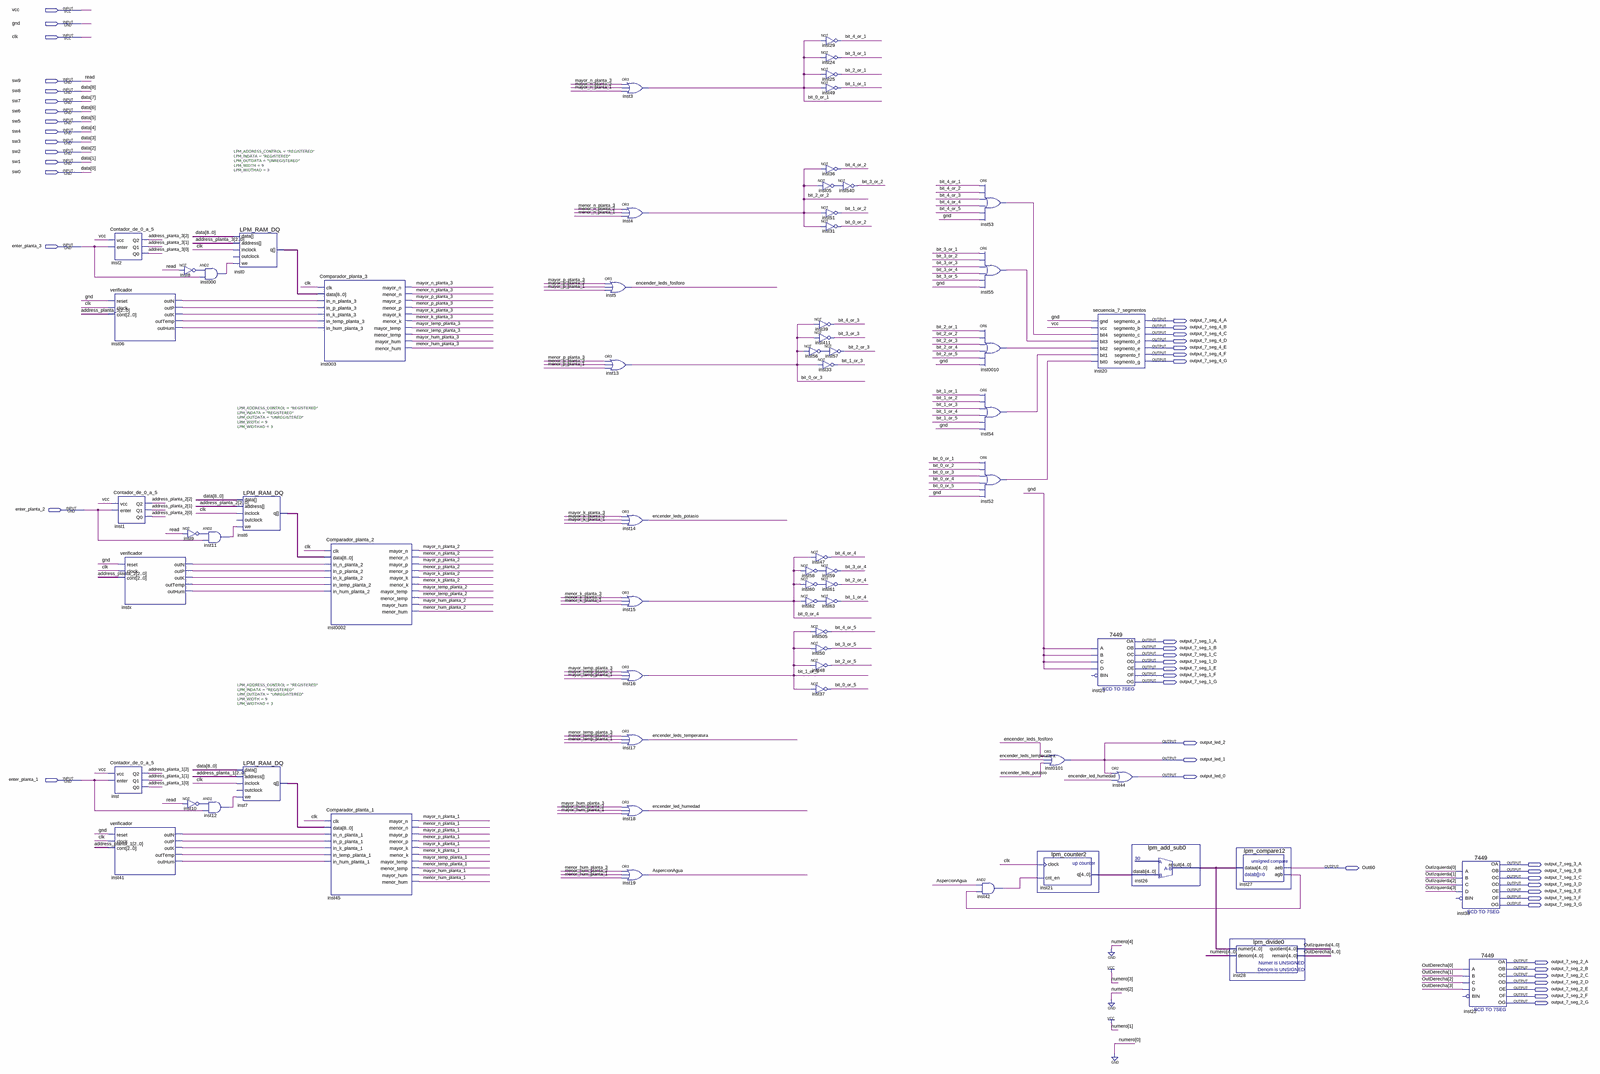
[diagram p0: schematic sheet, whole]
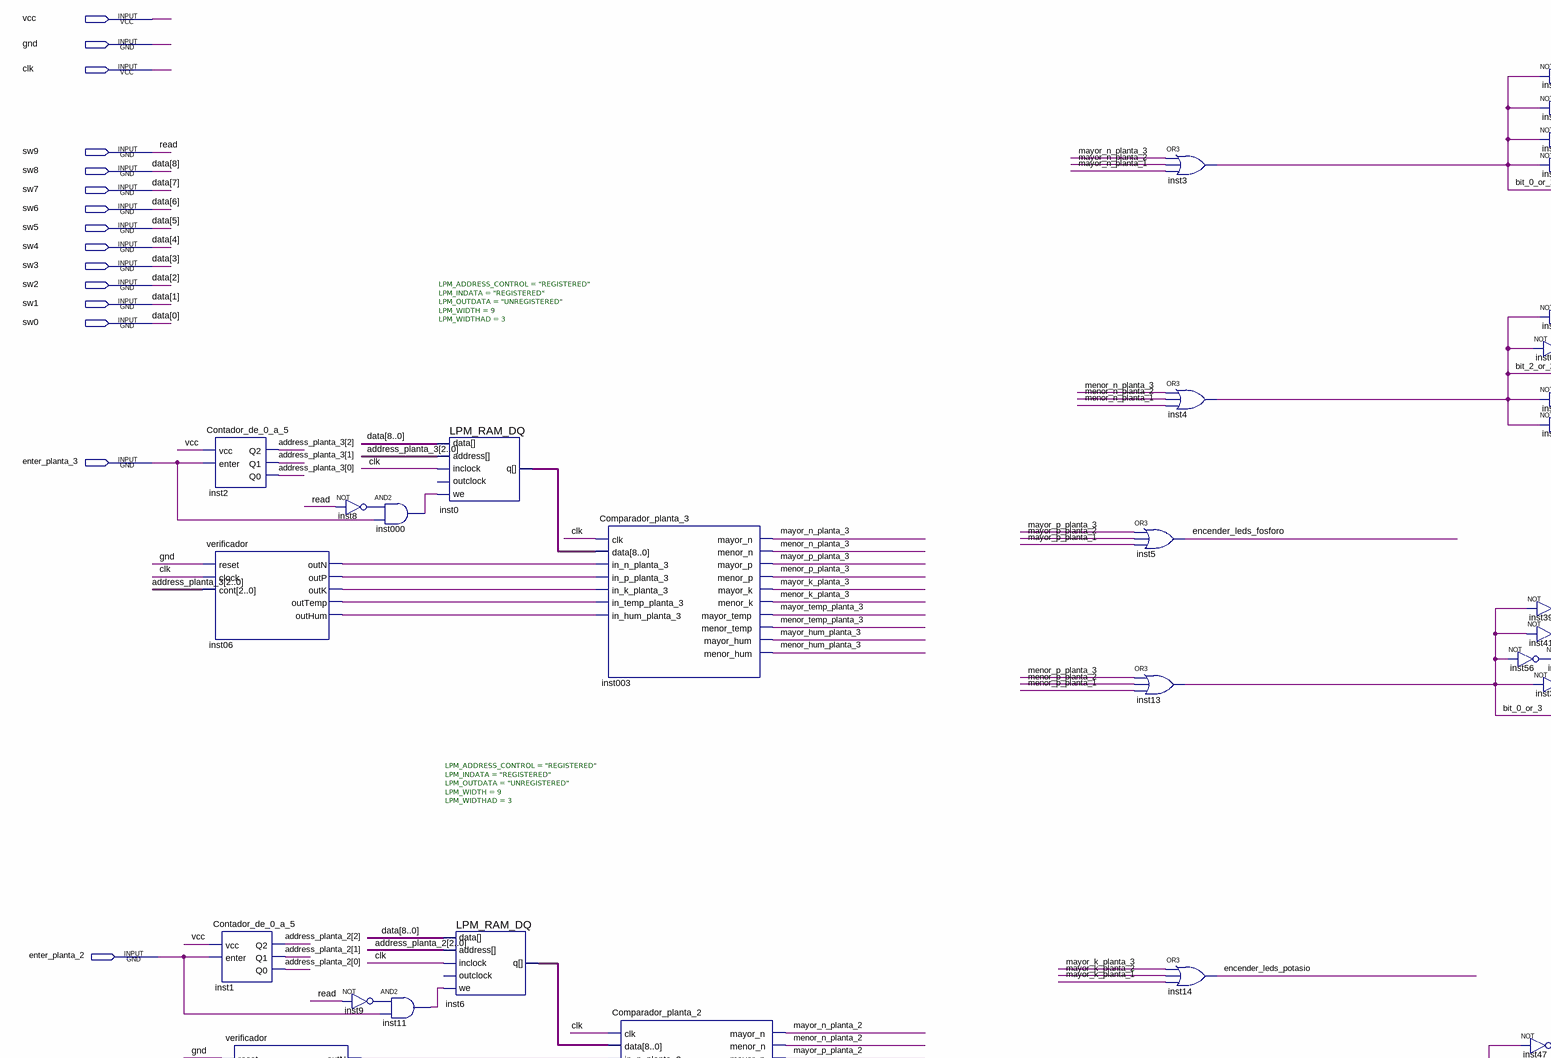
[diagram p1: schematic sheet, upper left part]
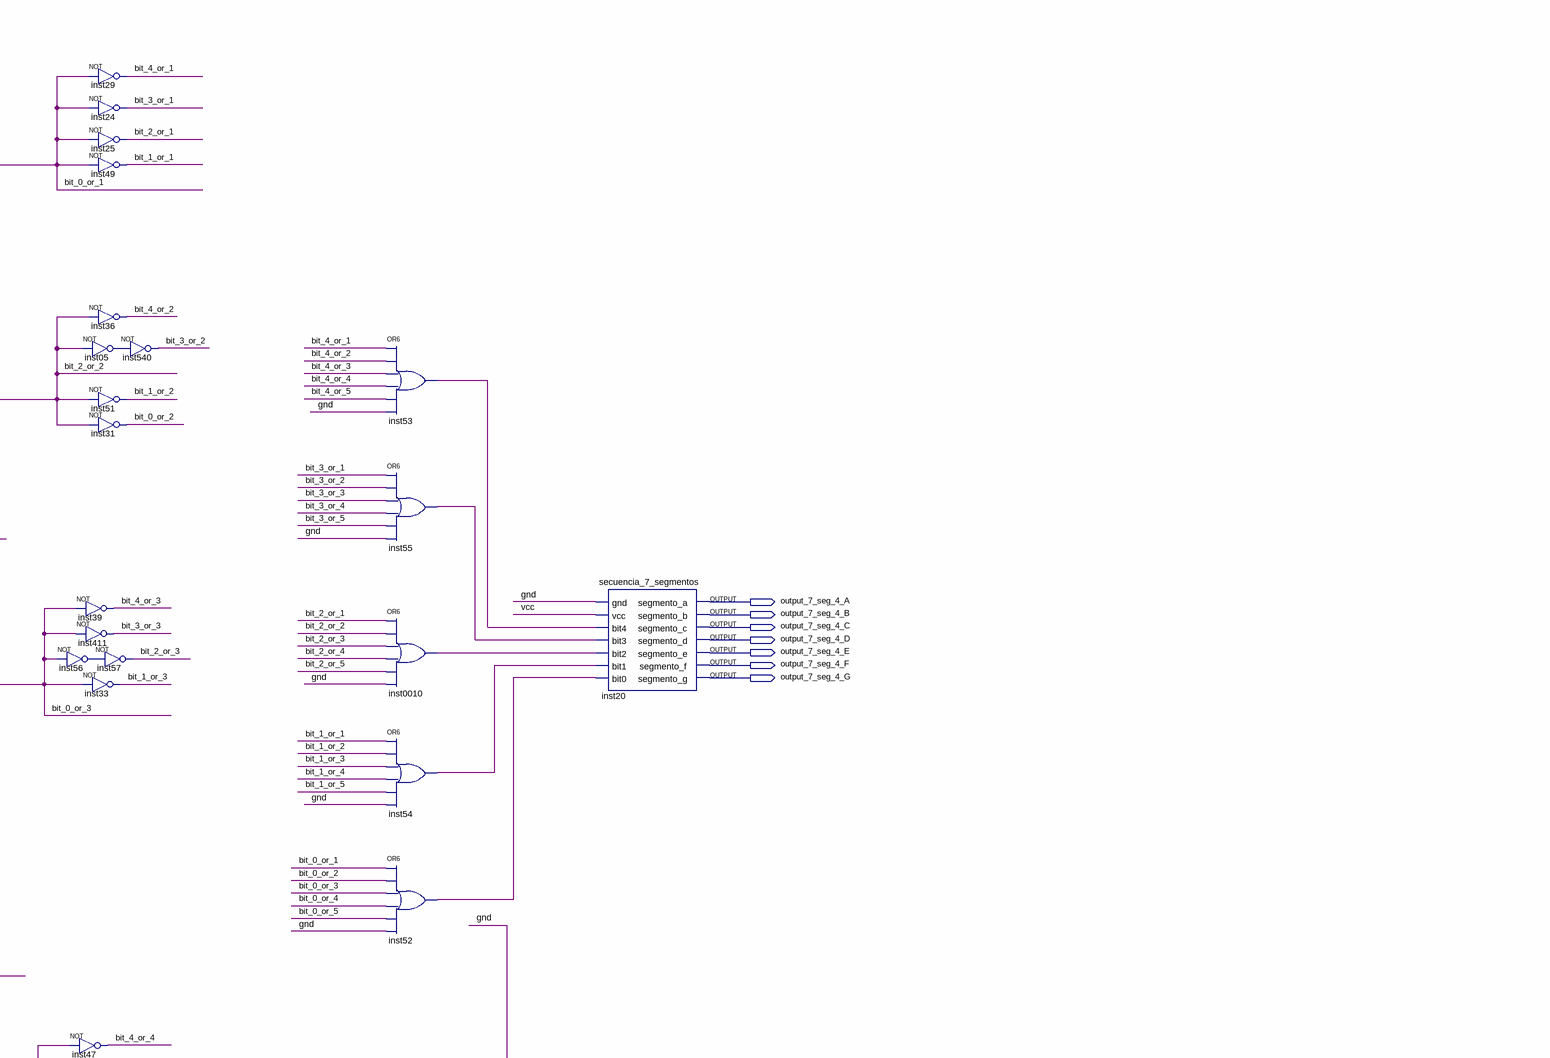
[diagram p2: schematic sheet, upper right part]
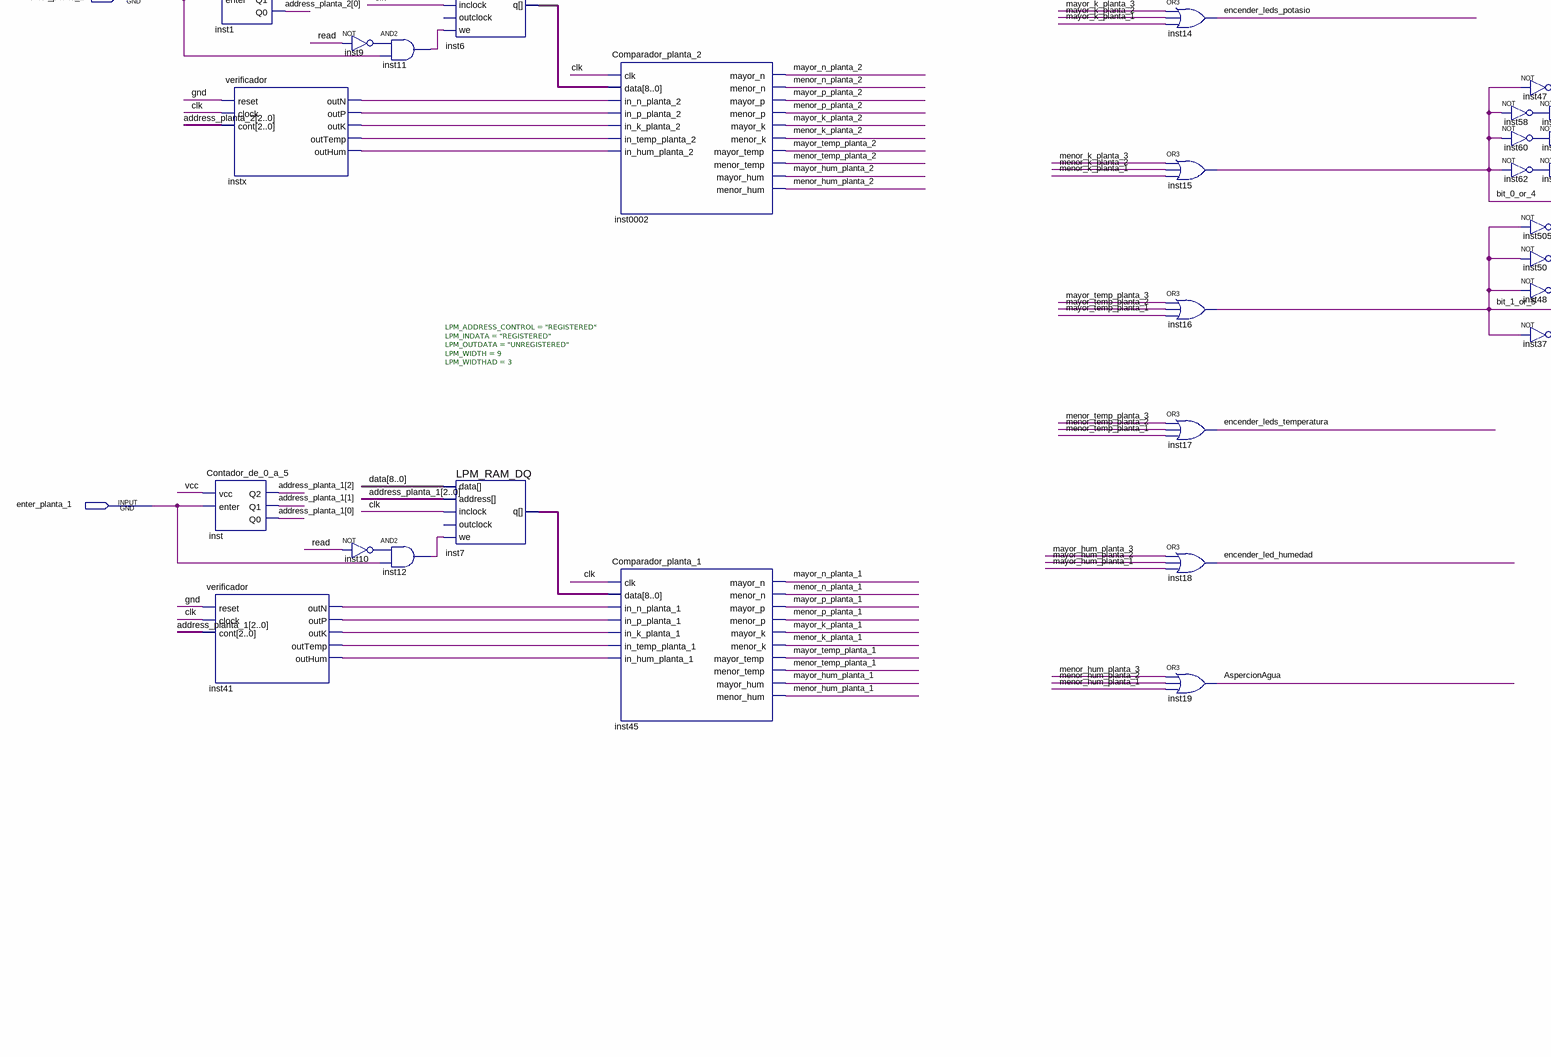
[diagram p3: schematic sheet, lower left part]
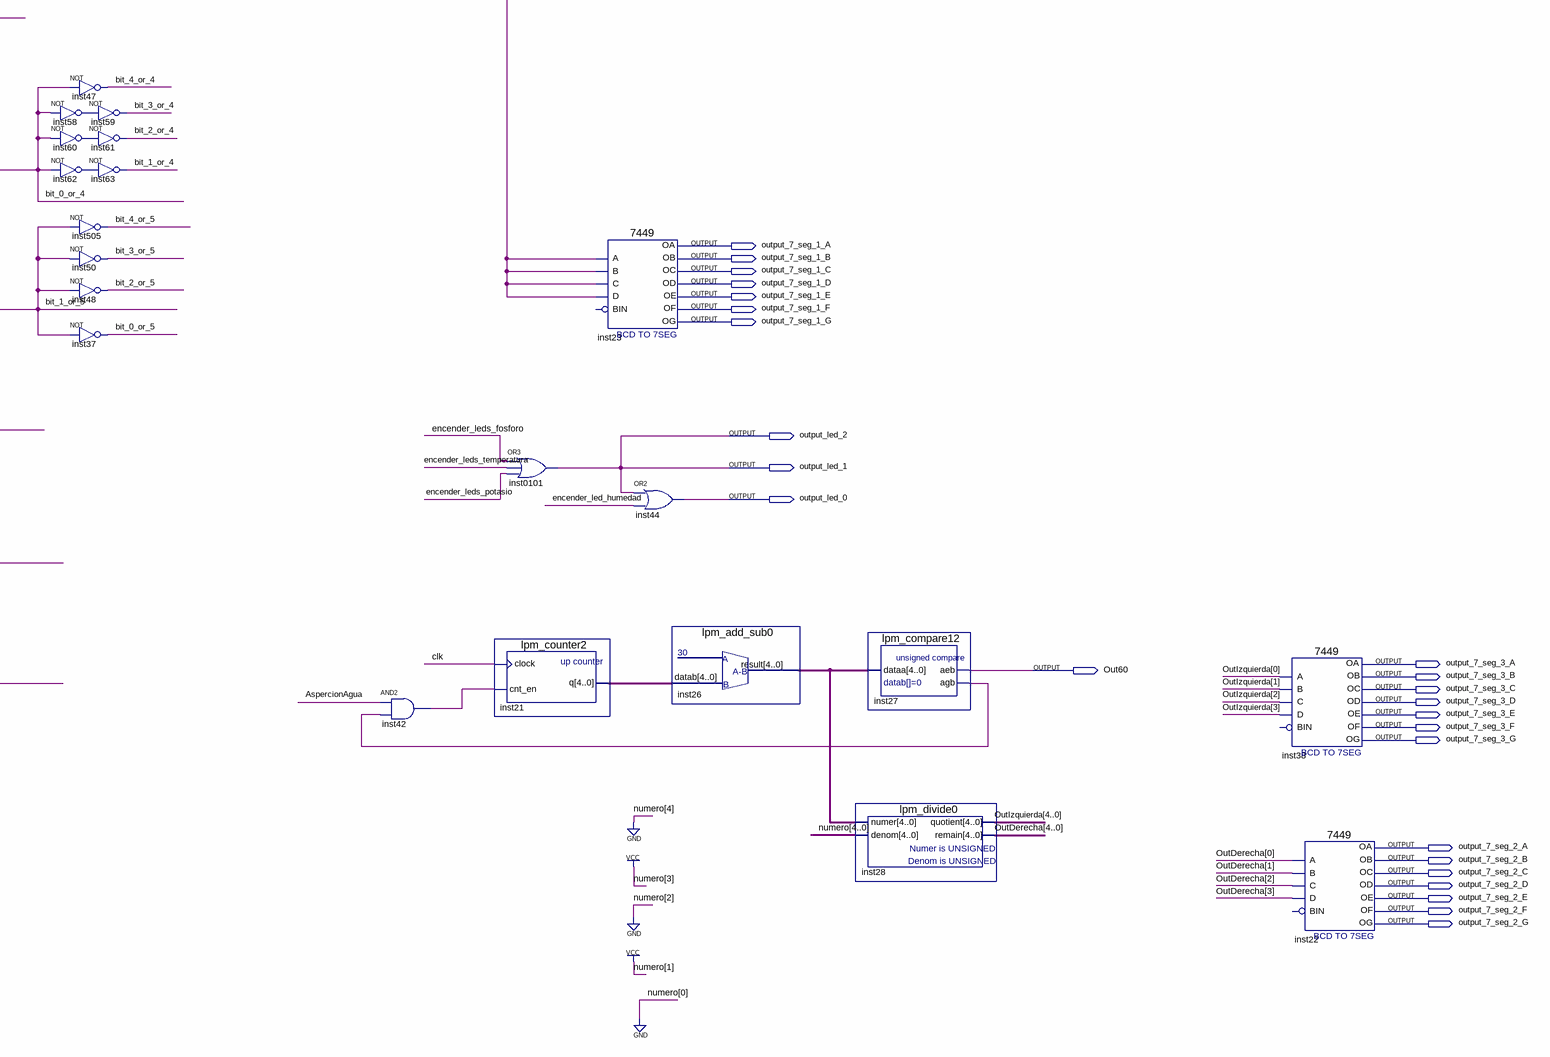
[diagram p4: schematic sheet, lower right part]
// Quartus schematic Huerta_Automatizada.bdf as structural Verilog: 69 symbols, 48 pins
module Huerta_Automatizada (
  input  vcc,
  input  gnd,
  input  clk,
  input  sw9,
  input  sw8,
  input  sw7,
  input  sw6,
  input  sw5,
  input  sw4,
  input  sw3,
  input  sw2,
  input  sw1,
  input  sw0,
  input  enter_planta_3,
  input  enter_planta_2,
  input  enter_planta_1,
  output output_7_seg_4_A,
  output output_7_seg_4_B,
  output output_7_seg_4_C,
  output output_7_seg_4_D,
  output output_7_seg_4_E,
  output output_7_seg_4_F,
  output output_7_seg_4_G,
  output output_7_seg_1_A,
  output output_7_seg_1_B,
  output output_7_seg_1_C,
  output output_7_seg_1_D,
  output output_7_seg_1_E,
  output output_7_seg_1_F,
  output output_7_seg_1_G,
  output output_led_2,
  output output_led_1,
  output output_led_0,
  output output_7_seg_3_A,
  output Out60,
  output output_7_seg_3_B,
  output output_7_seg_3_C,
  output output_7_seg_3_D,
  output output_7_seg_3_E,
  output output_7_seg_3_F,
  output output_7_seg_3_G,
  output output_7_seg_2_A,
  output output_7_seg_2_B,
  output output_7_seg_2_C,
  output output_7_seg_2_D,
  output output_7_seg_2_E,
  output output_7_seg_2_F,
  output output_7_seg_2_G
);

  wire AspercionAgua, bit_0_or_1, bit_0_or_2, bit_0_or_3, bit_0_or_4, bit_0_or_5, bit_1_or_1, bit_1_or_2,
       bit_1_or_3, bit_1_or_4, bit_1_or_5, bit_2_or_1, bit_2_or_2, bit_2_or_3, bit_2_or_4, bit_2_or_5,
       bit_3_or_1, bit_3_or_2, bit_3_or_3, bit_3_or_4, bit_3_or_5, bit_4_or_1, bit_4_or_2, bit_4_or_3,
       bit_4_or_4, bit_4_or_5, encender_led_humedad, encender_leds_fosforo, encender_leds_potasio,
       encender_leds_temperatura, inst000_out, inst05_out, inst06_outhum, inst06_outk, inst06_outn,
       inst06_outp, inst06_outtemp, inst8_out, inst9_out, inst0010_out, inst10_out, inst11_out, inst12_out,
       inst27_agb, inst41_outhum, inst41_outk, inst41_outn, inst41_outp, inst41_outtemp, inst42_out,
       inst52_out, inst53_out, inst54_out, inst55_out, inst56_out, inst58_out, inst60_out, inst62_out,
       instx_outhum, instx_outk, instx_outn, instx_outp, instx_outtemp, mayor_hum_planta_1,
       mayor_hum_planta_2, mayor_hum_planta_3, mayor_k_planta_1, mayor_k_planta_2, mayor_k_planta_3,
       mayor_n_planta_1, mayor_n_planta_2, mayor_n_planta_3, mayor_p_planta_1, mayor_p_planta_2,
       mayor_p_planta_3, mayor_temp_planta_1, mayor_temp_planta_2, mayor_temp_planta_3, menor_hum_planta_1,
       menor_hum_planta_2, menor_hum_planta_3, menor_k_planta_1, menor_k_planta_2, menor_k_planta_3,
       menor_n_planta_1, menor_n_planta_2, menor_n_planta_3, menor_p_planta_1, menor_p_planta_2,
       menor_p_planta_3, menor_temp_planta_1, menor_temp_planta_2, menor_temp_planta_3;
  wire [2:0] address_planta_1, address_planta_2, address_planta_3;
  wire [4:0] inst21_q, inst26_result, OutDerecha, OutIzquierda;
  wire [8:0] inst0_q, inst6_q, inst7_q;

  Contador_de_0_a_5 inst2 (
    .vcc(vcc), .enter(enter_planta_3), .Q2(address_planta_3[2]), .Q1(address_planta_3[1]),
    .Q0(address_planta_3[0]));
  verificador inst06 (
    .reset(gnd), .clock(clk), .cont(address_planta_3), .outN(inst06_outn), .outP(inst06_outp),
    .outK(inst06_outk), .outTemp(inst06_outtemp), .outHum(inst06_outhum));
  Contador_de_0_a_5 inst1 (
    .vcc(vcc), .enter(enter_planta_2), .Q2(address_planta_2[2]), .Q1(address_planta_2[1]),
    .Q0(address_planta_2[0]));
  Contador_de_0_a_5 inst (
    .vcc(vcc), .enter(enter_planta_1), .Q2(address_planta_1[2]), .Q1(address_planta_1[1]),
    .Q0(address_planta_1[0]));
  verificador inst41 (
    .reset(gnd), .clock(clk), .cont(address_planta_1), .outN(inst41_outn), .outP(inst41_outp),
    .outK(inst41_outk), .outTemp(inst41_outtemp), .outHum(inst41_outhum));
  verificador instx (
    .reset(gnd), .clock(clk), .cont(address_planta_2), .outN(instx_outn), .outP(instx_outp),
    .outK(instx_outk), .outTemp(instx_outtemp), .outHum(instx_outhum));
  not inst8 (inst8_out, sw9);
  not inst9 (inst9_out, sw9);
  not inst10 (inst10_out, sw9);
  and inst000 (inst000_out, inst8_out, enter_planta_3);
  and inst11 (inst11_out, inst9_out, enter_planta_2);
  and inst12 (inst12_out, inst10_out, enter_planta_1);
  LPM_RAM_DQ #(.LPM_ADDRESS_CONTROL("REGISTERED"), .LPM_INDATA("REGISTERED"), .LPM_OUTDATA("UNREGISTERED"), .LPM_WIDTH(9), .LPM_WIDTHAD(3)) inst0 (
    .inclock(clk), .data({sw8, sw7, sw6, sw5, sw4, sw3, sw2, sw1, sw0}), .address(address_planta_3),
    .we(inst000_out), .q(inst0_q));  // open: outclock
  LPM_RAM_DQ #(.LPM_ADDRESS_CONTROL("REGISTERED"), .LPM_INDATA("REGISTERED"), .LPM_OUTDATA("UNREGISTERED"), .LPM_WIDTH(9), .LPM_WIDTHAD(3)) inst6 (
    .inclock(clk), .data({sw8, sw7, sw6, sw5, sw4, sw3, sw2, sw1, sw0}), .address(address_planta_2),
    .we(inst11_out), .q(inst6_q));  // open: outclock
  LPM_RAM_DQ #(.LPM_ADDRESS_CONTROL("REGISTERED"), .LPM_INDATA("REGISTERED"), .LPM_OUTDATA("UNREGISTERED"), .LPM_WIDTH(9), .LPM_WIDTHAD(3)) inst7 (
    .inclock(clk), .data({sw8, sw7, sw6, sw5, sw4, sw3, sw2, sw1, sw0}), .address(address_planta_1),
    .we(inst12_out), .q(inst7_q));  // open: outclock
  Comparador_planta_3 inst003 (
    .clk(clk), .data(inst0_q), .in_n_planta_3(inst06_outn), .in_p_planta_3(inst06_outp),
    .in_k_planta_3(inst06_outk), .in_temp_planta_3(inst06_outtemp), .in_hum_planta_3(inst06_outhum),
    .mayor_n(mayor_n_planta_3), .menor_n(menor_n_planta_3), .mayor_p(mayor_p_planta_3),
    .menor_p(menor_p_planta_3), .mayor_k(mayor_k_planta_3), .menor_k(menor_k_planta_3),
    .mayor_temp(mayor_temp_planta_3), .menor_temp(menor_temp_planta_3), .mayor_hum(mayor_hum_planta_3),
    .menor_hum(menor_hum_planta_3));
  Comparador_planta_2 inst0002 (
    .clk(clk), .data(inst6_q), .in_n_planta_2(instx_outn), .in_p_planta_2(instx_outp),
    .in_k_planta_2(instx_outk), .in_temp_planta_2(instx_outtemp), .in_hum_planta_2(instx_outhum),
    .mayor_n(mayor_n_planta_2), .menor_n(menor_n_planta_2), .mayor_p(mayor_p_planta_2),
    .menor_p(menor_p_planta_2), .mayor_k(mayor_k_planta_2), .menor_k(menor_k_planta_2),
    .mayor_temp(mayor_temp_planta_2), .menor_temp(menor_temp_planta_2), .mayor_hum(mayor_hum_planta_2),
    .menor_hum(menor_hum_planta_2));
  Comparador_planta_1 inst45 (
    .clk(clk), .data(inst7_q), .in_n_planta_1(inst41_outn), .in_p_planta_1(inst41_outp),
    .in_k_planta_1(inst41_outk), .in_temp_planta_1(inst41_outtemp), .in_hum_planta_1(inst41_outhum),
    .mayor_n(mayor_n_planta_1), .menor_n(menor_n_planta_1), .mayor_p(mayor_p_planta_1),
    .menor_p(menor_p_planta_1), .mayor_k(mayor_k_planta_1), .menor_k(menor_k_planta_1),
    .mayor_temp(mayor_temp_planta_1), .menor_temp(menor_temp_planta_1), .mayor_hum(mayor_hum_planta_1),
    .menor_hum(menor_hum_planta_1));
  or inst3 (bit_0_or_1, mayor_n_planta_3, mayor_n_planta_2, mayor_n_planta_1);
  or inst4 (bit_2_or_2, menor_n_planta_3, menor_n_planta_2, menor_n_planta_1);
  or inst5 (encender_leds_fosforo, mayor_p_planta_3, mayor_p_planta_2, mayor_p_planta_1);
  or inst13 (bit_0_or_3, menor_p_planta_3, menor_p_planta_2, menor_p_planta_1);
  or inst14 (encender_leds_potasio, mayor_k_planta_3, mayor_k_planta_2, mayor_k_planta_1);
  or inst15 (bit_0_or_4, menor_k_planta_3, menor_k_planta_2, menor_k_planta_1);
  or inst16 (bit_1_or_5, mayor_temp_planta_3, mayor_temp_planta_2, mayor_temp_planta_1);
  or inst17 (encender_leds_temperatura, menor_temp_planta_3, menor_temp_planta_2, menor_temp_planta_1);
  or inst18 (encender_led_humedad, mayor_hum_planta_3, mayor_hum_planta_2, mayor_hum_planta_1);
  or inst19 (AspercionAgua, menor_hum_planta_3, menor_hum_planta_2, menor_hum_planta_1);
  not inst39 (bit_4_or_3, bit_0_or_3);
  not inst411 (bit_3_or_3, bit_0_or_3);
  not inst56 (inst56_out, bit_0_or_3);
  not inst47 (bit_4_or_4, bit_0_or_4);
  not inst58 (inst58_out, bit_0_or_4);
  not inst60 (inst60_out, bit_0_or_4);
  not inst62 (inst62_out, bit_0_or_4);
  not inst505 (bit_4_or_5, bit_1_or_5);
  not inst50 (bit_3_or_5, bit_1_or_5);
  not inst48 (bit_2_or_5, bit_1_or_5);
  not inst37 (bit_0_or_5, bit_1_or_5);
  not inst29 (bit_4_or_1, bit_0_or_1);
  not inst24 (bit_3_or_1, bit_0_or_1);
  not inst25 (bit_2_or_1, bit_0_or_1);
  not inst49 (bit_1_or_1, bit_0_or_1);
  not inst36 (bit_4_or_2, bit_2_or_2);
  not inst05 (inst05_out, bit_2_or_2);
  not inst540 (bit_3_or_2, inst05_out);
  not inst51 (bit_1_or_2, bit_2_or_2);
  not inst31 (bit_0_or_2, bit_2_or_2);
  not inst57 (bit_2_or_3, inst56_out);
  not inst33 (bit_1_or_3, bit_0_or_3);
  not inst59 (bit_3_or_4, inst58_out);
  not inst61 (bit_2_or_4, inst60_out);
  not inst63 (bit_1_or_4, inst62_out);
  and inst42 (inst42_out, AspercionAgua, inst27_agb);
  or inst53 (inst53_out, bit_4_or_1, bit_4_or_2, bit_4_or_3, bit_4_or_4, bit_4_or_5, gnd);
  or inst55 (inst55_out, bit_3_or_1, bit_3_or_2, bit_3_or_3, bit_3_or_4, bit_3_or_5, gnd);
  or inst0010 (inst0010_out, bit_2_or_1, bit_2_or_2, bit_2_or_3, bit_2_or_4, bit_2_or_5, gnd);
  or inst54 (inst54_out, bit_1_or_1, bit_1_or_2, bit_1_or_3, bit_1_or_4, bit_1_or_5, gnd);
  or inst52 (inst52_out, bit_0_or_1, bit_0_or_2, bit_0_or_3, bit_0_or_4, bit_0_or_5, gnd);
  or inst0101 (output_led_1, encender_leds_fosforo, encender_leds_temperatura, encender_leds_potasio);
  lpm_counter2 inst21 (.clock(clk), .cnt_en(inst42_out), .q(inst21_q));
  secuencia_7_segmentos inst20 (
    .gnd(gnd), .vcc(vcc), .bit4(inst53_out), .bit3(inst55_out), .bit2(inst0010_out), .bit1(inst54_out),
    .bit0(inst52_out), .segmento_a(output_7_seg_4_A), .segmento_b(output_7_seg_4_B),
    .segmento_c(output_7_seg_4_C), .segmento_d(output_7_seg_4_D), .segmento_e(output_7_seg_4_E),
    .segmento_f(output_7_seg_4_F), .segmento_g(output_7_seg_4_G));
  \7449  inst23 (
    .A(gnd), .C(gnd), .B(gnd), .D(gnd), .OC(output_7_seg_1_C), .OD(output_7_seg_1_D), .OF(output_7_seg_1_F),
    .OG(output_7_seg_1_G), .OB(output_7_seg_1_B), .OA(output_7_seg_1_A), .OE(output_7_seg_1_E));  // open: BIN
  or inst44 (output_led_0, output_led_1, encender_led_humedad);
  lpm_add_sub0 inst26 (.datab(inst21_q), .result(inst26_result));
  lpm_compare12 inst27 (.dataa(inst26_result), .aeb(Out60), .agb(inst27_agb));
  lpm_divide0 inst28 (.numer(inst26_result), .denom(5'b01010), .quotient(OutIzquierda), .remain(OutDerecha));
  \7449  inst38 (
    .A(OutIzquierda[0]), .C(OutIzquierda[2]), .B(OutIzquierda[1]), .D(OutIzquierda[3]),
    .OC(output_7_seg_3_C), .OD(output_7_seg_3_D), .OF(output_7_seg_3_F), .OG(output_7_seg_3_G),
    .OB(output_7_seg_3_B), .OA(output_7_seg_3_A), .OE(output_7_seg_3_E));  // open: BIN
  \7449  inst22 (
    .A(OutDerecha[0]), .C(OutDerecha[2]), .B(OutDerecha[1]), .D(OutDerecha[3]), .OC(output_7_seg_2_C),
    .OD(output_7_seg_2_D), .OF(output_7_seg_2_F), .OG(output_7_seg_2_G), .OB(output_7_seg_2_B),
    .OA(output_7_seg_2_A), .OE(output_7_seg_2_E));  // open: BIN

  assign output_led_2 = output_led_1;

  // Other names for the same wires on the sheet: data[8:0] = {sw8, sw7, sw6, sw5, sw4, sw3, sw2, sw1, sw0};
  //   read = sw9
endmodule
